# EAGLE schematic first schematic (EAGLE 9.5.1)
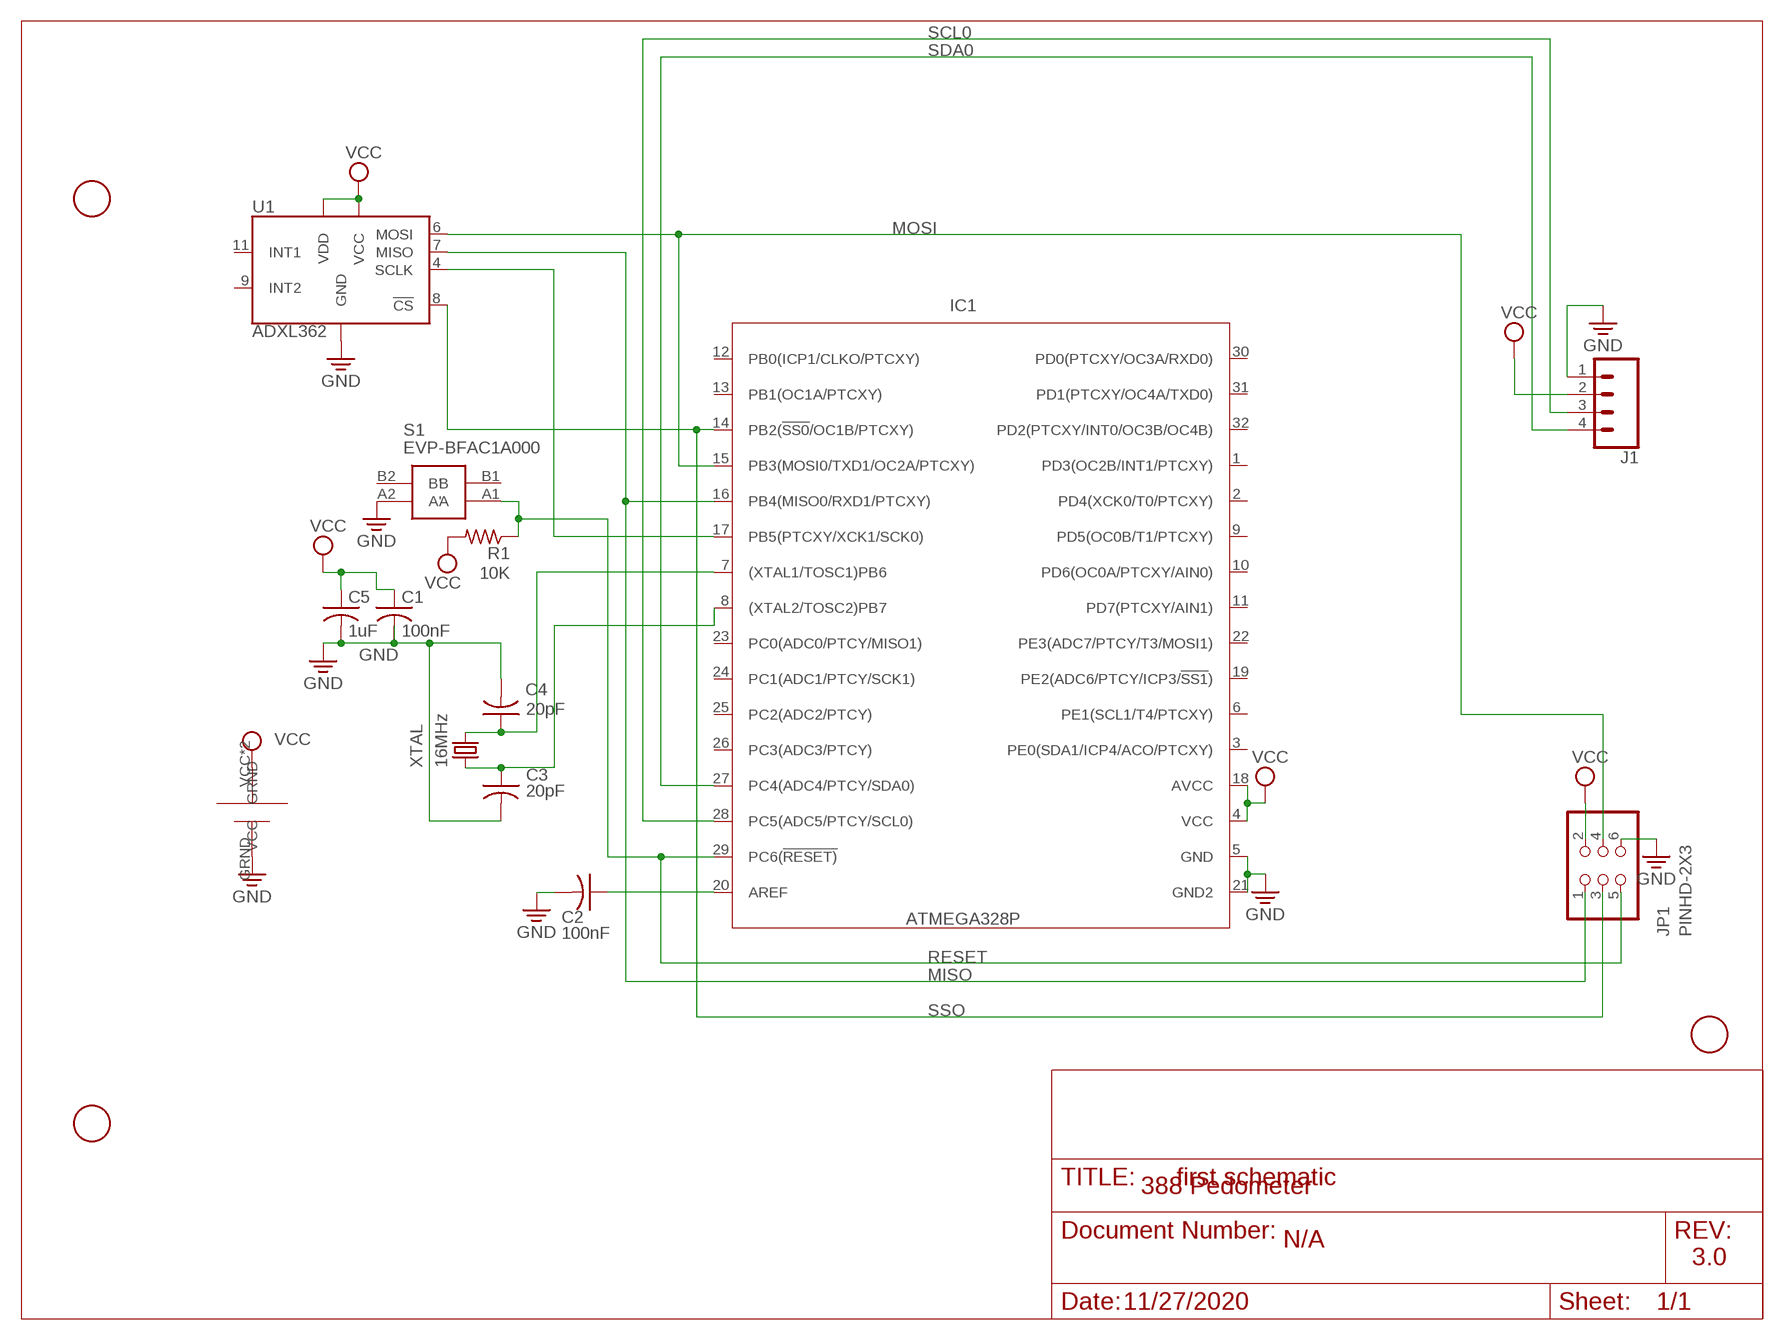
[diagram p0: schematic, sheet 1]

## Parts
C1  100nF  C-USC0805  [C0805]
C2  100nF  C-USC0805  [C0805]
C3  20pF  C-USC0805  [C0805]
C4  20pF  C-USC0805  [C0805]
C5  1uF  C-USC0805  [C0805]
IC1  ATMEGA328P  ATMEGA328PB_TQFP  [TQFP32-08]
J1  CONN_041X04_NO_SILK  [1X04_NO_SILK]
JP1  PINHD-2X3  [2X03]
R1  10K  R-US_R0805  [R0805]
S1  EVP-BFAC1A000  [EVPBFAC1A000]
U1  ADXL362  [TFLGA-16/3.3MMX3.1MM]
U$1  FIDUCIAL  [FIDUCIAL_1MM]
U$2  FIDUCIAL  [FIDUCIAL_1MM]
U$3  FIDUCIAL  [FIDUCIAL_1MM]
U$4  CR2032  [CR2032]
XTAL  16MHz  CRYSTALHC49UP  [HC49UP]

## Nets
AREFTOCAP: C2.1 IC1.20(AREF)
GND: C1.2 C2.2 C3.2 C4.2 C5.2 IC1.5(GND) IC1.21(GND2) J1.1 JP1.6 S1.A2(A') U1.12(GND) U1.13(GND) U1.16(GND) U$4.GRND
MISO: IC1.16(PB4(MISO0/RXD1/PTCXY)) JP1.1 U1.7(MISO)
MOSI: IC1.15(PB3(MOSI0/TXD1/OC2A/PTCXY)) JP1.4 U1.6(MOSI)
N$2: C4.1 IC1.7((XTAL1/TOSC1)PB6) XTAL.2
N$8: C3.1 IC1.8((XTAL2/TOSC2)PB7) XTAL.1
N$9: IC1.17(PB5(PTCXY/XCK1/SCK0)) U1.4(SCLK)
RESET: IC1.29(PC6(!RESET)) JP1.5 R1.1 S1.A1(A)
SCL0: IC1.28(PC5(ADC5/PTCY/SCL0)) J1.3
SDA0: IC1.27(PC4(ADC4/PTCY/SDA0)) J1.4
SSO: IC1.14(PB2(!SS0!/OC1B/PTCXY)) JP1.3 U1.8(!CS)
VCC: C1.1 C5.1 IC1.4(VCC) IC1.18(AVCC) J1.2 JP1.2 R1.2 U1.1(VDD) U1.14(VCC) U$4.VCC U$4.VCC2(VCC)
Unconnected: IC1.1(PD3(OC2B/INT1/PTCXY)) IC1.2(PD4(XCK0/T0/PTCXY)) IC1.3(PE0(SDA1/ICP4/ACO/PTCXY)) IC1.6(PE1(SCL1/T4/PTCXY)) IC1.9(PD5(OC0B/T1/PTCXY)) IC1.10(PD6(OC0A/PTCXY/AIN0)) IC1.11(PD7(PTCXY/AIN1)) IC1.12(PB0(ICP1/CLKO/PTCXY)) IC1.13(PB1(OC1A/PTCXY)) IC1.19(PE2(ADC6/PTCY/ICP3/!SS1!)) IC1.22(PE3(ADC7/PTCY/T3/MOSI1)) IC1.23(PC0(ADC0/PTCY/MISO1)) IC1.24(PC1(ADC1/PTCY/SCK1)) IC1.25(PC2(ADC2/PTCY)) IC1.26(PC3(ADC3/PTCY)) IC1.30(PD0(PTCXY/OC3A/RXD0)) IC1.31(PD1(PTCXY/OC4A/TXD0)) IC1.32(PD2(PTCXY/INT0/OC3B/OC4B)) S1.B1(B) S1.B2(B') U1.9(INT2) U1.11(INT1)

## Notes on the sheet
- 388 Pedometer
- N/A
- 3.0
- 11/27/2020

## Library data of the parts
C1-C5 = adafruit:C-US: CAPACITOR, American symbol
IC1 = IC_Embedded:ATMEGA328PB: 8-bit AVR Microcontroller with 32K Bytes In-System Programmable Flash Datasheet <http://ww1.microchip.com/downloads/en/DeviceDoc/40001906A.pdf>; CATEGORY: IC_Embedded; MANUFACTURER: Microchip; MPN: ATMEGA328PB-AN; OPERATING_TEMP: -40 to 105°C; PART_STATUS: Active; ROHS_COMPLIANT: Compliant; SUB-CATEGORY: Microcontroller
J1 = SparkFun-Connectors:CONN_04: Multi connection point. Often used as Generic Header-pin footprint for 0.1 inch spaced/style header connections On any of the 0.1 inch spaced packages, you can populate with these: Break Away Headers - Straight <https://www.sparkfun.com/products/116> (PRT-00116) Break Away Male Headers - Right Angle <https://www.sparkfun.com/products/553> (PRT-00553) Female Headers <https://www.sparkfun.com/products/115> (PRT-00115) Break Away Headers - Machine Pin <https://www.sparkfun.com/products/117> (PRT-00117) Break Away Female Headers - Swiss Machine Pin <https://www.sparkfun.com/products/743> (PRT-00743) For SCREWTERMINALS and SPRING TERMINALS visit here: Screw Terimnals on SparkFun.com <https://www.sparkfun.com/search/results?term=Screw+Terminals> (5mm/3.5mm/2.54mm spacing) This device is also useful as a general connection point to wire up your design to another part of your project. Our various solder wires solder well into these plated through hole pads. Hook-Up Wire - Assortment (Stranded, 22 AWG) <https://www.sparkfun.com/products/11375> (PRT-11375) Hook-Up Wire - Assortment (Solid Core, 22 AWG) <https://www.sparkfun.com/products/11367> (PRT-11367) View the entire wire category on our website here <https://www.sparkfun.com/categories/141> Special notes: Molex polarized connector foot print use with SKU : PRT-08231 with associated crimp pins and housings. 1MM SMD Version SKU: PRT-10208; PROD_ID: CONN-09696
JP1 = Connector:PINHD-2X3: PIN HEADER; CATEGORY: CONNECTOR; SUB-CATEGORY: PIN-HEADER
R1 = adafruit:R-US_: RESISTOR, American symbol
S1 = EVP-BFAC1A000:EVP-BFAC1A000: Tactile Switches 6.0x6.0x3.4mm 2N w/4 Term .25mm Trvl IP67 Source: Datasheet <https://industrial.panasonic.com/cdbs/www-data/pdf/ATK0000/ATK0000C432.pdf> Check prices <https://pricing.snapeda.com/parts/EVP-BFAC1A000/Panasonic%20Electronic/view-part?ref=eda>; AVAILABILITY: Warning; DESCRIPTION: Tactile Switch SPST-NO Top Actuated Surface Mount; MF: Panasonic Electronic; MP: EVP-BFAC1A000; PACKAGE: None; PRICE: None; PURCHASE-URL: https://pricing.snapeda.com/search/part/EVP-BFAC1A000/?ref=eda
U1 = ADXL362:ADXL362: IC ACCEL DIG LO PWR 3AX 16LGA Check prices <https://pricing.snapeda.com/parts/ADXL362/Analog%20Devices/view-part?ref=eda>; AVAILABILITY: Bad; DESCRIPTION: Accelerometer X, Y, Z Axis ±2g, 4g, 8g 6.25Hz ~ 400Hz 16-LGA (3x3.25); MF: Analog Devices; MP: ADXL362; PACKAGE: LGA-16 Analog Devices; PRICE: None
U$1-U$3 = adafruit:FIDUCIAL: For use by pick and place machines to calibrate the vision/machine, 1mm By microbuilder.eu
U$4 = cr2032:CR2032
XTAL = adafruit:CRYSTAL: CRYSTAL; OC_FARNELL: unknown; OC_NEWARK: unknown